# EAGLE design RoomIndicator.Outside (EAGLE 6.4)
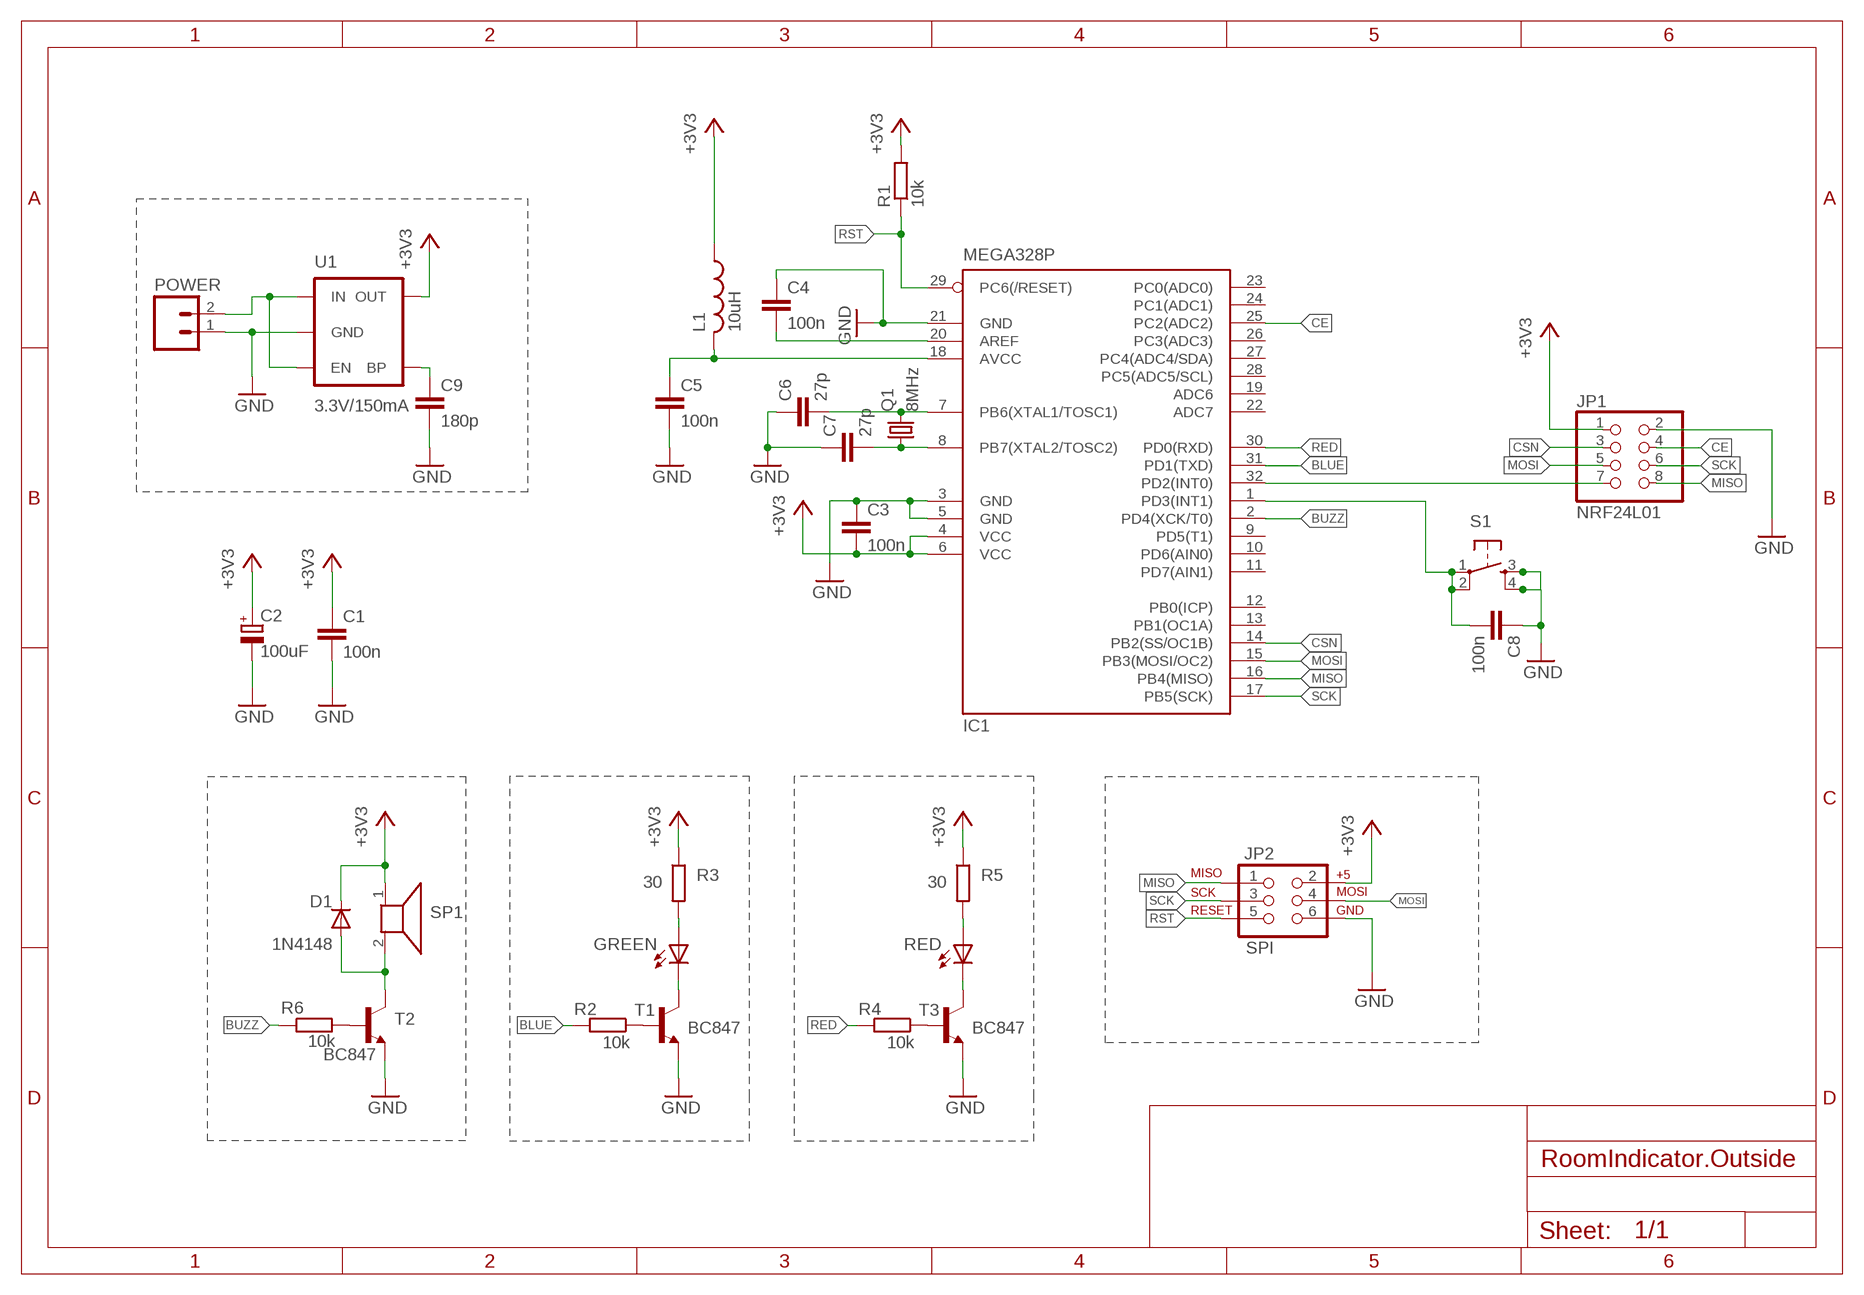
[diagram p0: schematic, sheet 1]

## Parts
C1  100n  C-EU025-025X050  [C025-025X050]
C2  100uF  CPOL-EUE2.5-5  [E2,5-5]
C3  100n  C-EUC0805K  [C0805K]
C4  100n  C-EUC0805K  [C0805K]
C5  100n  C-EUC0805K  [C0805K]
C6  27p  C-EUC0805K  [C0805K]
C7  27p  C-EUC0805K  [C0805K]
C8  100n  C-EUC0805K  [C0805K]
C9  180p  C-EUC0805K  [C0805K]
D1  1N4148  1N4148DO35-7  [DO35-7]
GREEN  GREEN  LED5MM  [LED5MM]
IC1  MEGA328P  MEGA8-AI  [TQFP32-08]
JP1  NRF24L01  PINHD-2X4  [2X04]
JP2  SPI  AVR_SPI_PRG_6PTH  [2X3]
L1  10uH  L-US0204/7  [0204/7]
POWER  M02PTH  [1X02]
Q1  8MHz  CRYSTALHC49S  [HC49/S]
R1  10k  R-EU_R0805  [R0805]
R2  10k  R-EU_R0805  [R0805]
R3  30  R-EU_0204/5  [0204/5]
R4  10k  R-EU_R0805  [R0805]
R5  30  R-EU_0204/5  [0204/5]
R6  10k  R-EU_R0805  [R0805]
RED  GREEN  LED5MM  [LED5MM]
S1  TAC_SWITCHPTH  [TACTILE-PTH]
SP1  AL60P  [AL60P]
T1  BC847  [SOT23]
T2  BC847  [SOT23]
T3  BC847  [SOT23]
U1  3.3V/150mA  V_REG_MIC52053.3V  [SOT23-5]

## Nets
+3V3: C1.1 C2.+ C3.2 D1.C IC1.4(VCC) IC1.6(VCC) JP1.1 JP2.2 L1.1 R1.2 R3.1 R5.1 SP1.1 U1.5(OUT)
AVCC: C5.1 IC1.18(AVCC) L1.2
BLUE: IC1.31(PD1(TXD)) R2.2
BUZZ: IC1.2(PD4(XCK/T0)) R6.1
CE: IC1.25(PC2(ADC2)) JP1.4
CSN: IC1.14(PB2(SS/OC1B)) JP1.3
GND: C1.2 C2.- C3.1 C4.1 C5.2 C6.1 C7.1 C8.1 C9.2 IC1.3(GND) IC1.5(GND) IC1.21(GND) JP1.2 JP2.6 POWER.1 S1.3 S1.4 T1.2(E) T2.2(E) T3.2(E) U1.2(GND)
INT0: IC1.32(PD2(INT0)) JP1.7
INT1: C8.2 IC1.1(PD3(INT1)) S1.1 S1.2
MISO: IC1.16(PB4(MISO)) JP1.8 JP2.1
MOSI: IC1.15(PB3(MOSI/OC2)) JP1.5 JP2.4
N$1: POWER.2 U1.1(IN) U1.3(EN)
N$2: R4.1 T3.1(B)
N$3: RED.K(C) T3.3(C)
N$4: C4.2 IC1.20(AREF)
N$5: R6.2 T2.1(B)
N$6: GREEN.A R3.2
N$7: R5.2 RED.A
N$8: C9.1 U1.4(BP)
N$10: R2.1 T1.1(B)
N$11: GREEN.K(C) T1.3(C)
N$16: D1.A SP1.2 T2.3(C)
RED: IC1.30(PD0(RXD)) R4.2
RST: IC1.29(PC6(/RESET)) JP2.5 R1.1
SCK: IC1.17(PB5(SCK)) JP1.6 JP2.3
TOSC1: C6.2 IC1.7(PB6(XTAL1/TOSC1)) Q1.2
TOSC2: C7.2 IC1.8(PB7(XTAL2/TOSC2)) Q1.1
Unconnected: IC1.9(PD5(T1)) IC1.10(PD6(AIN0)) IC1.11(PD7(AIN1)) IC1.12(PB0(ICP)) IC1.13(PB1(OC1A)) IC1.19(ADC6) IC1.22(ADC7) IC1.23(PC0(ADC0)) IC1.24(PC1(ADC1)) IC1.26(PC3(ADC3)) IC1.27(PC4(ADC4/SDA)) IC1.28(PC5(ADC5/SCL))

## Library data of the parts
C1 C3-C9 = rcl:C-EU: CAPACITOR, European symbol
C2 = rcl:CPOL-EU: POLARIZED CAPACITOR, European symbol
D1 = diode:1N4148: DIODE high speed (Philips)
GREEN RED = led:LED: LED OSRAM: - CHIPLED LG R971, LG N971, LY N971, LG Q971, LY Q971, LO R971, LY R971 LH N974, LH R974 LS Q976, LO Q976, LY Q976 LO Q996 - Hyper CHIPLED LW Q18S LB Q993, LB Q99A, LB R99A - SideLED LS A670, LO A670, LY A670, LG A670, LP A670 LB A673, LV A673, LT A673, LW A673 LH A674 LY A675 LS A676, LA A676, LO A676, LY A676, LW A676 LS A679, LY A679, LG A679 - Hyper Micro SIDELED® LS Y876, LA Y876, LO Y876, LY Y876 LT Y87S - SmartLED LW L88C, LW L88S LB L89C, LB L89S, LG L890 LS L89K, LO L89K, LY L89K LS L896, LA L896, LO L896, LY L896 - TOPLED LS T670, LO T670, LY T670, LG T670, LP T670 LSG T670, LSP T670, LSY T670, LOP T670, LYG T670 LG T671, LOG T671, LSG T671 LB T673, LV T673, LT T673, LW T673 LH T674 LS T676, LA T676, LO T676, LY T676, LB T676, LH T676, LSB T676, LW T676 LB T67C, LV T67C, LT T67C, LS T67K, LO T67K, LY T67K, LW E67C LS E67B, LA E67B, LO E67B, LY E67B, LB E67C, LV E67C, LT E67C LW T67C LS T679, LY T679, LG T679 LS T770, LO T770, LY T770, LG T770, LP T770 LB T773, LV T773, LT T773, LW T773 LH T774 LS E675, LA E675, LY E675, LS T675 LS T776, LA T776, LO T776, LY T776, LB T776 LHGB T686 LT T68C, LB T68C - Hyper Mini TOPLED® LB M676 - Mini TOPLED Santana® LG M470 LS M47K, LO M47K, LY M47K Source: http://www.osram.convergy.de LUXEON: - LUMILED® LXK2-PW12-R00, LXK2-PW12-S00, LXK2-PW14-U00, LXK2-PW14-V00 LXK2-PM12-R00, LXK2-PM12-S00, LXK2-PM14-U00 LXK2-PE12-Q00, LXK2-PE12-R00, LXK2-PE12-S00, LXK2-PE14-T00, LXK2-PE14-U00 LXK2-PB12-K00, LXK2-PB12-L00, LXK2-PB12-M00, LXK2-PB14-N00, LXK2-PB14-P00, LXK2-PB14-Q00 LXK2-PR12-L00, LXK2-PR12-M00, LXK2-PR14-Q00, LXK2-PR14-R00 LXK2-PD12-Q00, LXK2-PD12-R00, LXK2-PD12-S00 LXK2-PH12-R00, LXK2-PH12-S00 LXK2-PL12-P00, LXK2-PL12-Q00, LXK2-PL12-R00 Source: www.luxeon.com KINGBRIGHT: KA-3528ASYC Source: www.kingbright.com
IC1 = atmel:MEGA8: MICROCONTROLLER 8 Kbytes FLASH, 1 kbytes SRAM, 512 bytes EEPROM, USART, 6-channel 10 bit ADC, 2-channel 8 bit ADC Pin compatible with Atmega48, ATMega88, ATMega168 Source: avr.lbr; MPN: ATMEGA8-16AU; OC_FARNELL: 9171371; OC_NEWARK: 73M8863
JP1 = pinhead:PINHD-2X4: PIN HEADER
JP2 = SparkFun-Connectors:AVR_SPI_PRG_6: AVR ISP 6 Pin This is the reduced ISP connector for AVR programming. Common on Arduino. This footprint will take up less PCB space and can be used with a 10-pin to 6-pin adapter such as SKU: BOB-08508 **Special note about "TEST_POINT" package. The stop mask is on the top side, so if you want your programming test points to be on the bottom of your board, make sure to place this package on the bottom side of the board. This also ensure that the orientation to program from the bottom side will be correct.
L1 = rcl:L-US: INDUCTOR, American symbol
POWER = SparkFun-Connectors:M02: Standard 2-pin 0.1" header. Use with - straight break away headers ( PRT-00116) - right angle break away headers (PRT-00553) - swiss pins (PRT-00743) - machine pins (PRT-00117) - female headers (PRT-00115) Molex polarized connector foot print use with: PRT-08233 with associated crimp pins and housings. 2.54_SCREWTERM for use with PRT-10571. 3.5mm Screw Terminal footprints for PRT-08084 5mm Screw Terminal footprints for use with PRT-08432
Q1 = crystal:CRYSTAL: CRYSTAL; OC_FARNELL: 1667008; OC_NEWARK: unknown
R1-R6 = rcl:R-EU_: RESISTOR, European symbol
S1 = SparkFun-Retired:TAC_SWITCH: Momentary Switch Button commonly used for reset or general input. Spark Fun Electronics SKU : COM-00097 SMT- SWCH-08247
SP1 = buzzer:AL60P: SPEAKER Source: Buerklin; OC_FARNELL: unknown; OC_NEWARK: unknown
T1-T3 = transistor:BC847: NPN TRANSISTOR
U1 = SparkFun-PowerIC:V_REG_MIC5205: V_REG MIC5205 Standard 3.3V, 5V, and Adjustable 150mA LDO voltage regulator in SOT-23 layout. Micrel part MIC5205. BP (by-pass) pin is used to lower output noise with 470pF cap, may be left open. On the adjustable version BP is used to set output.; PROD_ID: VREG-00822

## Board
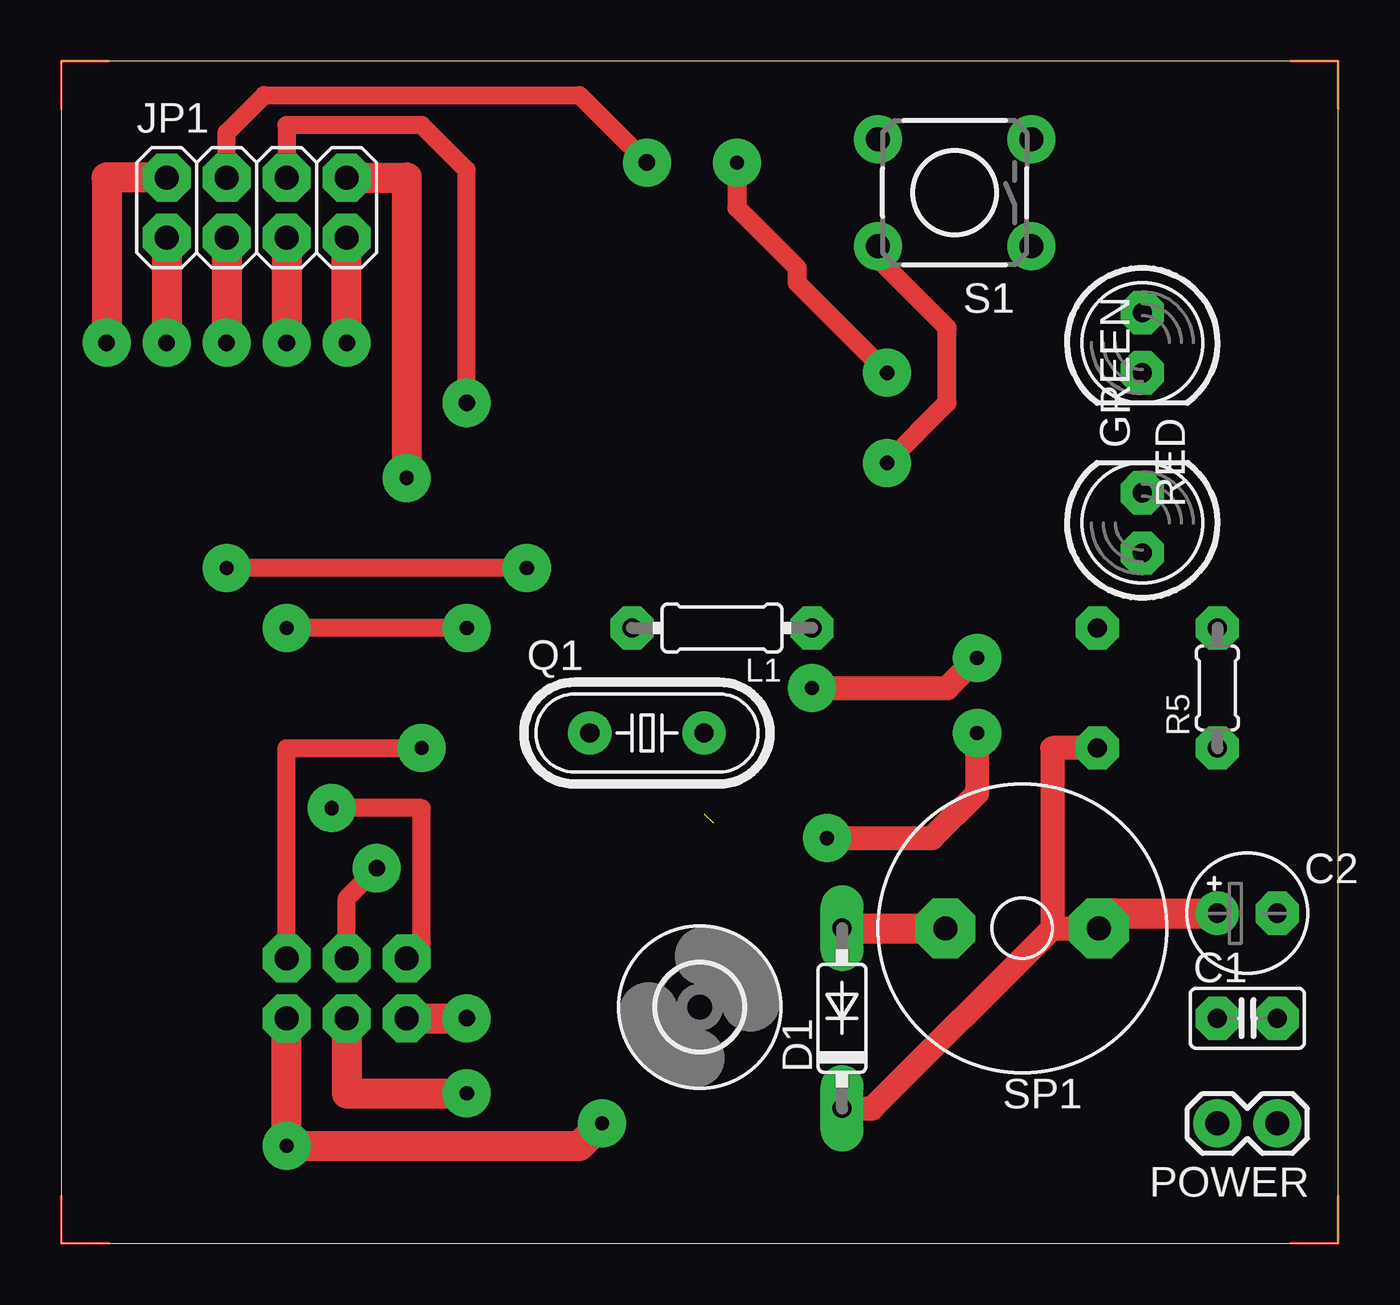
[diagram p1: board, top side]
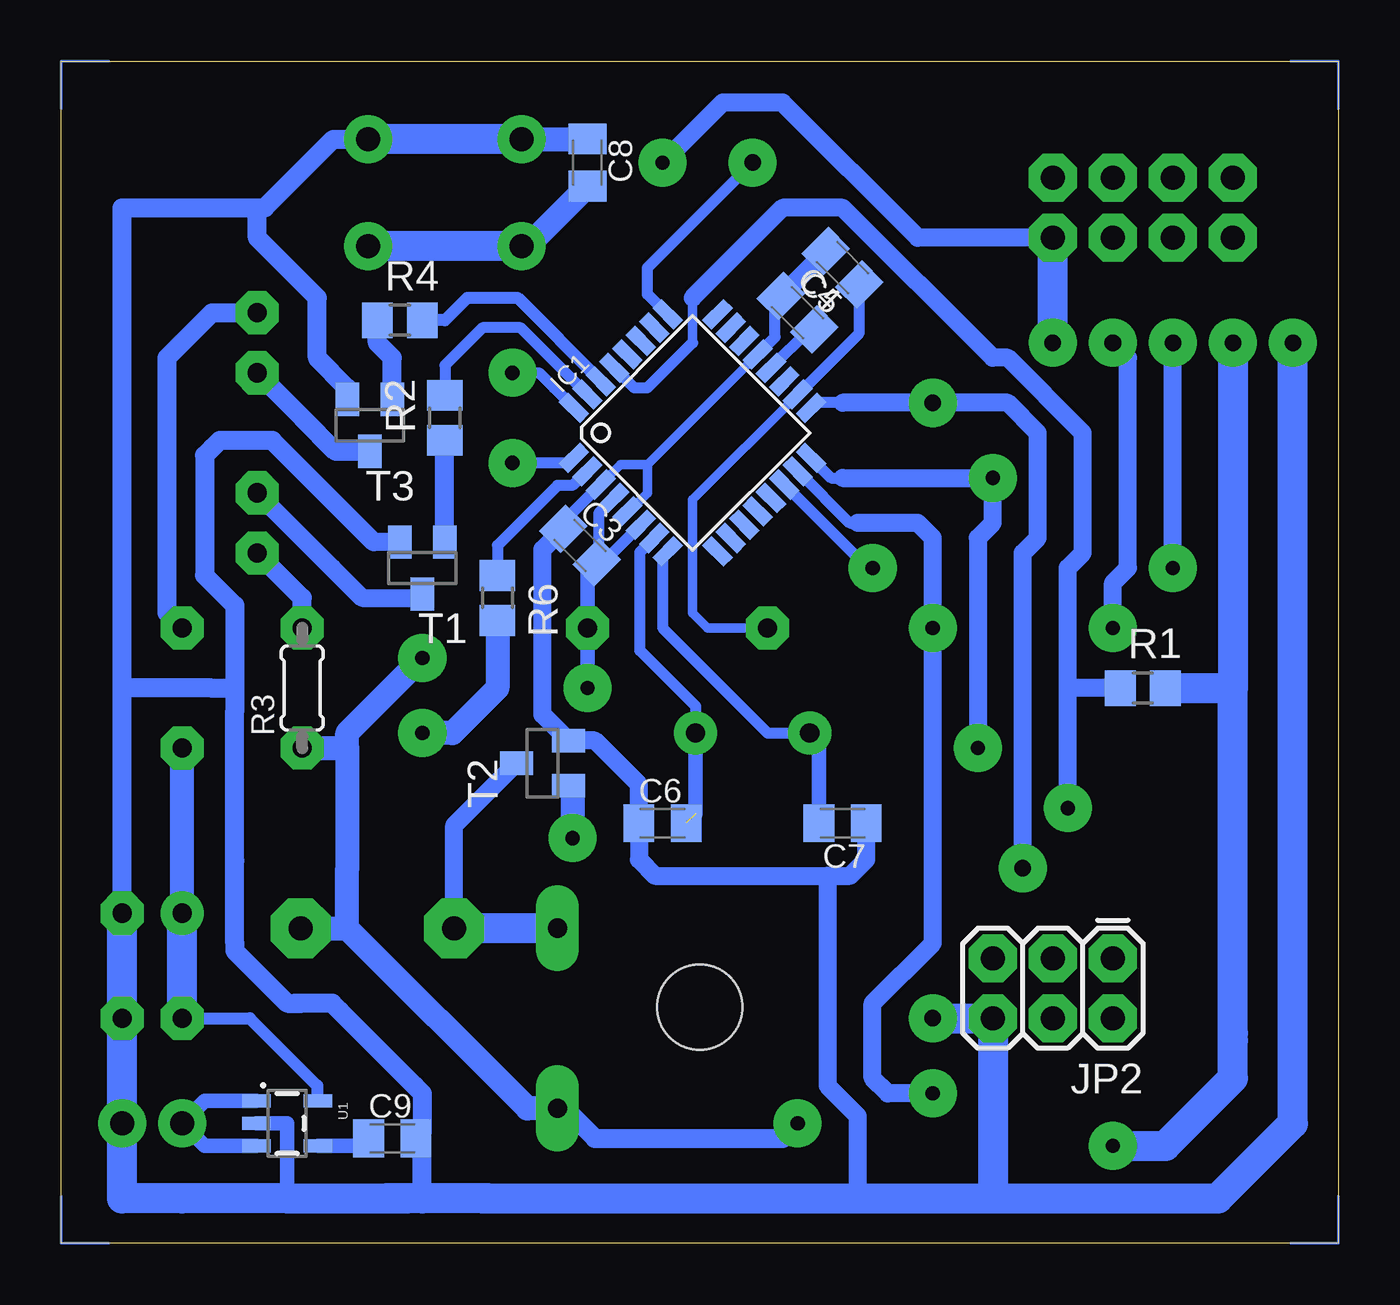
[diagram p2: board, bottom side, seen from below]

Size 54 x 50 mm. Coordinates in mm from the lower left corner, seen from the top.
Outline: 0,0 54,0 54,50 0,50 0,0
Copper layers (1*16): Top 0.035mm / dielectric 1.5mm / Bottom 0.035mm
Design rules "default *": minimum track width 10mil, minimum drill 24mil, track to track 8mil, track to pad 8mil, pad to pad 8mil, via to via 8mil, smd to smd 8mil, copper to edge 40mil, drill to drill 8mil, minimum pad ring 20mil, minimum via ring 10mil, stop-mask expansion 4mil, vias tented up to drill 0mil, thermal gap 10mil

### Footprints (pad centres in the part's own frame; a part is rotated, then mirrored left to right if it is on the bottom)
C025-025X050 = drill 0.813 octagon: 1 -1.27,0; 2 1.27,0
E2,5-5 = drill 0.813 pad 1.6: + -1.27,0 | drill 0.813 pad 1.6 octagon: - 1.27,0
C0805K = smd 1.3 x 1.6: 1 -1,0; 2 1,0
DO35-7 = drill 0.813 long: A 3.81,0; C -3.81,0
LED5MM = drill 0.813 octagon: A -1.27,0; K 1.27,0
TQFP32-08 = smd 1.27 x 0.559: 1 -4.293,2.8; 2 -4.293,2; 3 -4.293,1.2; 4 -4.293,0.4; 5 -4.293,-0.4; 6 -4.293,-1.2; 7 -4.293,-2; 8 -4.293,-2.8; 17 4.293,-2.8; 18 4.293,-2; 19 4.293,-1.2; 20 4.293,-0.4; 21 4.293,0.4; 22 4.293,1.2; 23 4.293,2; 24 4.293,2.8 | smd 0.559 x 1.27: 9 -2.8,-4.293; 10 -2,-4.293; 11 -1.2,-4.293; 12 -0.4,-4.293; 13 0.4,-4.293; 14 1.2,-4.293; 15 2,-4.293; 16 2.8,-4.293; 25 2.8,4.293; 26 2,4.293; 27 1.2,4.293; 28 0.4,4.293; 29 -0.4,4.293; 30 -1.2,4.293; 31 -2,4.293; 32 -2.8,4.293
2X04 = drill 1.016 octagon: 1 -3.81,-1.27; 2 -3.81,1.27; 3 -1.27,-1.27; 4 -1.27,1.27; 5 1.27,-1.27; 6 1.27,1.27; 7 3.81,-1.27; 8 3.81,1.27
2X3 = drill 1.016 pad 1.88 octagon: 1 0,0; 2 0,2.54; 3 2.54,0; 4 2.54,2.54; 5 5.08,0; 6 5.08,2.54
0204/7 = drill 0.813 octagon: 1 -3.81,0; 2 3.81,0
1X02 = drill 1.016 pad 1.88: 1 0,0; 2 2.54,0
HC49/S = drill 0.813: 1 -2.413,0; 2 2.413,0
R0805 = smd 1.3 x 1.5: 1 -0.95,0; 2 0.95,0
0204/5 = drill 0.813 octagon: 1 -2.54,0; 2 2.54,0
TACTILE-PTH = drill 1.016 pad 1.88: 1 -3.251,2.261; 2 3.251,2.261; 3 -3.251,-2.261; 4 3.251,-2.261
AL60P = drill 1.016 pad 2.54 octagon: 1 -3.251,0; 2 3.251,0
SOT23 = smd 1 x 1.4: 1 -0.95,-1.1; 2 0.95,-1.1; 3 0,1.1
SOT23-5 = smd 0.55 x 1.2: 1 -0.95,-1.3; 2 0,-1.3; 3 0.95,-1.3; 4 0.95,1.3; 5 -0.95,1.3
3,6 = hole 3.6: 0,0

### Placement (x,y rotation side)
C1  50.16,9.53 0 top
C2  50.16,13.97 0 top
C3  32.07,29.53 315 bottom
C4  22.86,39.37 315 bottom
C5  20.95,41.27 135 bottom
C6  28.57,17.78 0 bottom
C7  20.95,17.78 180 bottom
C8  31.75,45.72 270 bottom
C9  40.01,4.45 0 bottom
D1  33.02,9.53 90 top
GREEN  45.72,30.48 90 top
IC1  27.3,34.29 45 bottom
JP1  8.26,43.81 0 top
JP2  9.53,12.06 180 bottom
L1  27.94,26.04 180 top
POWER  51.44,5.08 180 top
Q1  24.77,21.59 0 top
R1  8.26,23.5 0 bottom
R2  37.78,34.92 90 bottom
R3  43.81,23.5 90 bottom
R4  39.69,39.05 0 bottom
R5  48.9,23.5 90 top
R6  35.56,27.3 270 bottom
RED  45.72,38.1 270 top
S1  37.78,44.45 180 top
SP1  40.64,13.34 180 top
T1  38.73,28.57 180 bottom
T2  33.66,20.32 90 bottom
T3  40.96,34.61 180 bottom
U1  44.45,5.08 270 bottom
U$1  [3,6]  27,10 0 top

### Tracks (layer width: path | path; a pad name or v marks a point on that pad's centre or on a via)
+3V3  (via drill 0.6 pad 2.03, 0.7 pad 2.03)
  Top 1.016: v31.75,23.5 37.47,23.5 v38.73,24.77 | D1.C 34.29,5.71 41.91,13.34 | 41.91,13.34 43.81,13.34 | R3.1 41.91,20.95 41.91,13.34
  Top 1.27: JP1.1 v4.45,38.1 | JP2.2 v9.53,4.13 21.91,4.13 v22.86,5.08 | SP1.1 44.53,13.97 C2.+
  Bottom 0.457: IC1.6 30.76,29.14 C3.2 31.27,28.91 31.27,30.89 IC1.4
  Bottom 0.508: C1.1 46.04,9.53 43.18,6.67 43.18,6.06 U1.5
  Bottom 0.61: C3.2 31.75,28.43 L1.1 v31.75,23.5
  Bottom 0.813: D1.C 32.7,5.71 31.43,4.45 23.5,4.45 v22.86,5.08
  Bottom 1.016: 41.91,20.95 41.91,21.59 v38.73,24.77 | C2.+ R5.1 | R3.1 41.91,20.95 | 41.91,20.95 41.91,15.88 41.91,13.34 | SP1.1 41.91,13.34 | D1.C 34.29,5.71 41.91,13.34
  Bottom 1.27: C1.1 C2.+ | v4.45,38.1 4.45,23.5 | R1.2 4.45,23.5 | 4.45,23.5 4.45,8.89 4.45,8.57 4.45,6.99 7.3,4.13 v9.53,4.13
AVCC
  Bottom 0.406: L1.2 26.67,26.04 27.3,26.67 27.3,31.46 IC1.18
  Bottom 0.457: IC1.18 20.25,38.52 C5.1
BLUE
  Bottom 0.457: IC1.31 34.58,38.73 36.2,38.73 37.78,37.15 R2.2
BUZZ
  Bottom 0.457: IC1.2 31.78,32.67 32.38,32.07 33.02,32.07 35.56,29.53 R6.1
CE  (via drill 0.7 pad 2.03)
  Top 0.762: JP1.4 6.99,46.99 8.57,48.58 21.91,48.58 22.86,47.62 23.18,47.31 v24.77,45.72
  Bottom 0.457: IC1.25 29.21,40.16 29.21,41.27 v24.77,45.72
CSN  (via drill 0.6 pad 2.03, 0.7 pad 2.03)
  Top 0.762: v19.68,28.57 v6.99,28.57
  Top 1.27: JP1.3 v6.99,38.1
  Bottom 0.457: IC1.14 19.89,28.57 v19.68,28.57
  Bottom 0.762: v6.99,28.57 v6.99,38.1
GND  (via drill 0.7 pad 2.03)
  Top 1.27: JP1.2 1.91,45.09 v1.91,38.1 | JP2.6 v17.14,9.53
  Bottom 0.406: 29.21,32.95 29.21,31.75 29.99,30.97 IC1.5 | IC1.21 29.21,32.95 | IC1.3 30.34,32.95 29.21,32.95
  Bottom 0.457: 32.74,30.55 C3.1 32.77,30.52 IC1.3 | IC1.21 23.81,38.35 23.81,39.83 C4.1
  Bottom 0.61: 33.09,30.41 C3.1 | U1.2 44.45,5.08 44.45,1.91
  Bottom 0.762: C3.1 33.66,29.35 33.66,22.37 T2.2 31.43,21.27 29.57,19.41 C6.1 29.57,16.24 28.89,15.56 21.59,15.56 | C5.2 C4.1 | 21.59,15.56 20.64,15.56 19.95,16.24 C7.1 | 21.59,15.56 21.59,6.67 20.32,5.4 20.32,1.91 | T1.2 40.79,29.68
  Bottom 0.813: C2.- 51.44,18.73 51.44,23.5 | 51.44,23.5 51.44,31.75 51.44,43.81 45.72,43.81 | 51.44,23.5 47.62,23.5 46.67,23.5 | 45.72,43.81 45.4,43.81 45.24,43.97 42.51,46.71 S1.3 | 40.79,29.68 45.09,33.97 47.31,33.97 47.62,33.66 47.94,33.34 47.94,28.26 46.67,26.99 46.67,23.5 | 46.67,23.5 46.67,22.54 46.67,16.19 46.67,12.7 46.67,12.38 44.45,10.16 44.13,10.16 | T3.2 41.91,36.19 43.18,37.47 43.18,40.01 45.09,41.91 45.24,42.07 45.72,42.55 45.72,43.81 | 44.13,10.16 43.81,10.16 | 38.73,5.08 38.73,6.35 39.05,6.67 42.23,9.84 42.55,10.16 44.13,10.16 | 38.73,5.08 38.73,4.71 C9.2 | 38.73,1.91 38.73,5.08
  Bottom 1.016: 34.6,46.71 C8.1
  Bottom 1.27: 35.88,1.91 36.2,1.91 | 36.2,1.91 35.88,1.91 | 35.88,1.91 35.56,1.91 27.94,1.91 20.32,1.91 14.61,1.91 | 14.61,1.91 5.08,1.91 1.91,5.08 v1.91,38.1 | C2.- C1.2 POWER.1 51.44,1.91 48.9,1.91 44.45,1.91 39.37,1.91 | 14.61,1.91 JP2.6 v17.14,9.53 | 34.6,46.71 S1.4 34.6,46.71 | 34.6,46.71 S1.3 | 36.2,1.91 38.73,1.91 39.37,1.91 | 39.37,1.91 40.32,1.91
INT0  (via drill 0.6 pad 2.03, 0.7 pad 2.03)
  Top 0.813: v28.57,45.72 28.57,43.81 31.11,41.27 31.11,40.64 v34.92,36.83
  Top 1.27: v12.06,38.1 JP1.7
  Bottom 0.457: IC1.32 33.17,36.2 33.8,36.83 v34.92,36.83
  Bottom 0.762: JP1.7 17.78,42.55 23.5,48.26 26.04,48.26 v28.57,45.72
  Bottom 1.27: v12.06,38.1 JP1.7
INT1  (via drill 0.6 pad 2.03)
  Top 0.813: v34.92,33.02 37.47,35.56 37.47,38.73 36.2,40.01 34.53,41.67 S1.2
  Bottom 0.457: IC1.1 32.53,33.02 v34.92,33.02
  Bottom 1.016: 35.23,42.19 34.28,42.19 C8.2
  Bottom 1.27: 35.23,42.19 S1.2 35.23,42.19 | 35.23,42.19 S1.1
MISO  (via drill 0.6 pad 2.03)
  Top 0.762: JP2.1 9.53,20.95 v15.24,20.95
  Top 1.27: JP1.8 14.61,45.09 v14.61,32.38
  Bottom 0.457: IC1.16 21.44,32.38 20.95,32.38
  Bottom 0.762: 20.95,32.38 v14.61,32.38 14.61,30.48 15.24,29.84 v15.24,20.95
MOSI  (via drill 0.6 pad 2.03, 0.7 pad 2.03)
  Top 0.762: v17.14,26.04 v9.53,26.04
  Top 1.27: JP1.5 v9.53,38.1 | JP2.4 12.06,6.35 v17.14,6.35
  Bottom 0.457: IC1.15 20.67,30.48 20.32,30.48
  Bottom 0.762: 20.32,30.48 17.78,30.48 17.14,29.84 v17.14,26.04 17.14,12.7 19.68,10.16 19.68,6.99 19.05,6.35 v17.14,6.35 | v9.53,26.04 9.53,27.94 8.89,28.57 8.89,37.47 v9.53,38.1
N$1
  Bottom 0.61: U1.1 47.95,6.03 POWER.2 47.95,4.13 U1.3
N$2
  Bottom 0.813: T3.1 40.01,37.47 40.64,38.1 R4.1
N$3
  Bottom 0.813: T3.3 42.4,33.51 43.81,34.92 44.77,35.88 RED.K
N$4
  Bottom 0.457: IC1.20 22.37,38.66 C4.2
N$5  (via drill 0.6 pad 2.03)
  Top 1.016: v32.38,17.14 36.83,17.14 38.73,19.05 v38.73,21.59
  Bottom 1.016: T2.1 32.38,19.37 v32.38,17.14 | R6.2 35.56,23.5 37.47,21.59 v38.73,21.59
N$6
  Bottom 0.813: R3.2 43.81,27.3 GREEN.A
N$7
  Bottom 0.813: R5.2 49.53,26.67 49.53,37.47 47.62,39.37 RED.A
N$8
  Bottom 0.61: U1.4 41.32,4.13 C9.1
N$9
  Bottom 0.1: 0,48 0,50 2,50
N$10
  Bottom 0.813: T1.1 R2.1
N$11
  Bottom 0.762: T1.3 38.91,27.3 41.27,27.3 42.55,28.57 GREEN.K
N$12
  Bottom 0.1: 52,50 54,50 54,48
N$13
  Bottom 0.1: 52,0 54,0 54,2
N$14
  Bottom 0.1: 0,2 0,0 2,0
N$15
  Top 0.1: 0,48 0,50 2,50
N$16
  Top 1.27: D1.A SP1.2
  Bottom 0.762: SP1.2 37.39,17.69 T2.3
  Bottom 1.27: D1.A 37.47,13.34
N$17
  Top 0.1: 52,50 54,50 54,48
N$18
  Top 0.1: 52,0 54,0 54,2
N$19
  Top 0.1: 0,2 0,0 2,0
RED
  Bottom 0.508: IC1.30 34.72,40.01 36.83,40.01 37.78,39.05 R4.2
RST  (via drill 0.6 pad 2.03)
  Top 0.762: JP2.5 15.24,12.7 15.24,18.41 v11.43,18.41
  Bottom 0.406: 27.3,38.1 27.3,40.01
  Bottom 0.457: IC1.29 29.78,36.2 29.21,36.2 27.3,38.1
  Bottom 0.762: 27.3,40.01 23.5,43.81 20.95,43.81 14.61,37.47 13.97,37.47 10.79,34.29 10.79,29.21 11.43,28.57 11.43,23.5 | R1.1 11.43,23.5 | v11.43,18.41 11.43,23.5
SCK  (via drill 0.7 pad 2.03)
  Top 0.762: v17.14,35.56 17.14,45.4 15.24,47.31 9.53,47.31 JP1.6 | JP2.3 12.06,14.61 v13.34,15.88
  Bottom 0.457: 20.95,35.56 22.07,35.56 IC1.17
  Bottom 0.762: 20.95,35.56 v17.14,35.56 13.97,35.56 12.7,34.29 12.7,29.84 13.34,29.21 v13.34,15.88
TOSC1  (1 unrouted)
  Bottom 0.457: Q1.2 27.18,22.73 29.53,25.08 29.53,29.24 IC1.7
  Bottom 0.61: 27.18,18.18 Q1.2
TOSC2
  Bottom 0.457: IC1.8 28.57,29.06 28.57,26.04 24.13,21.59 Q1.1
  Bottom 0.61: Q1.1 21.95,21.19 C7.2